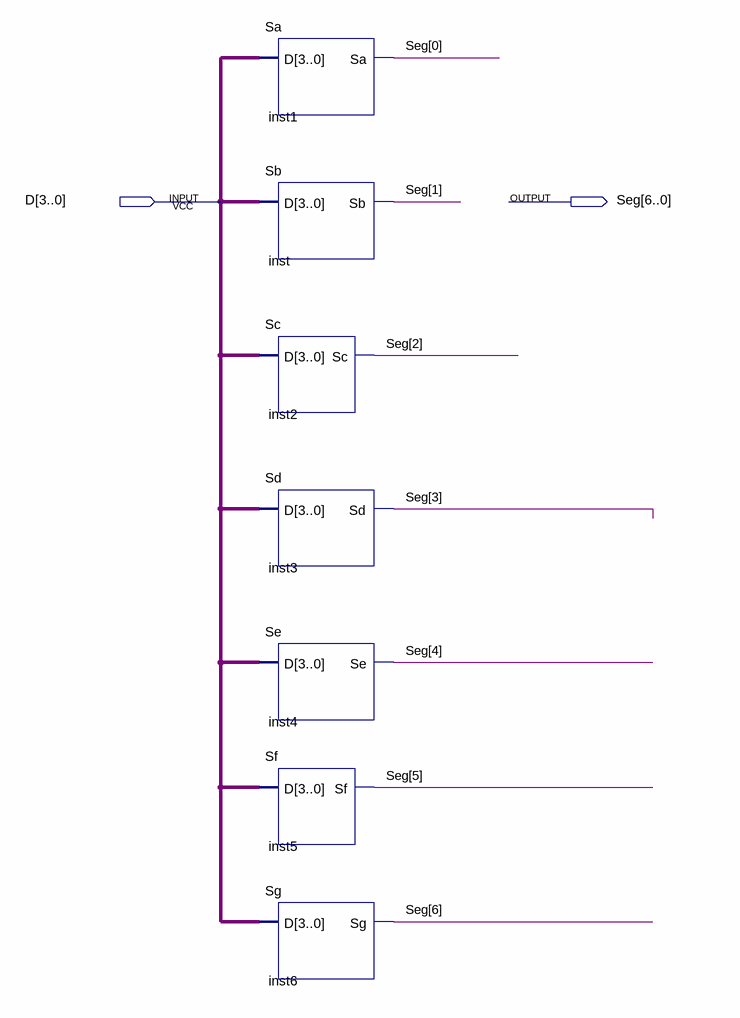
[diagram p0: schematic sheet]
// Quartus schematic Lab3.bdf as structural Verilog: 7 symbols, 2 pins
module Lab3 (
  input  [3:0] D,
  output [6:0] Seg
);

  Sa inst1 (.D(D), .Sa(Seg[0]));
  Sb inst (.D(D), .Sb(Seg[1]));
  Sc inst2 (.D(D), .Sc(Seg[2]));
  Sd inst3 (.D(D), .Sd(Seg[3]));
  Se inst4 (.D(D), .Se(Seg[4]));
  Sf inst5 (.D(D), .Sf(Seg[5]));
  Sg inst6 (.D(D), .Sg(Seg[6]));
endmodule
